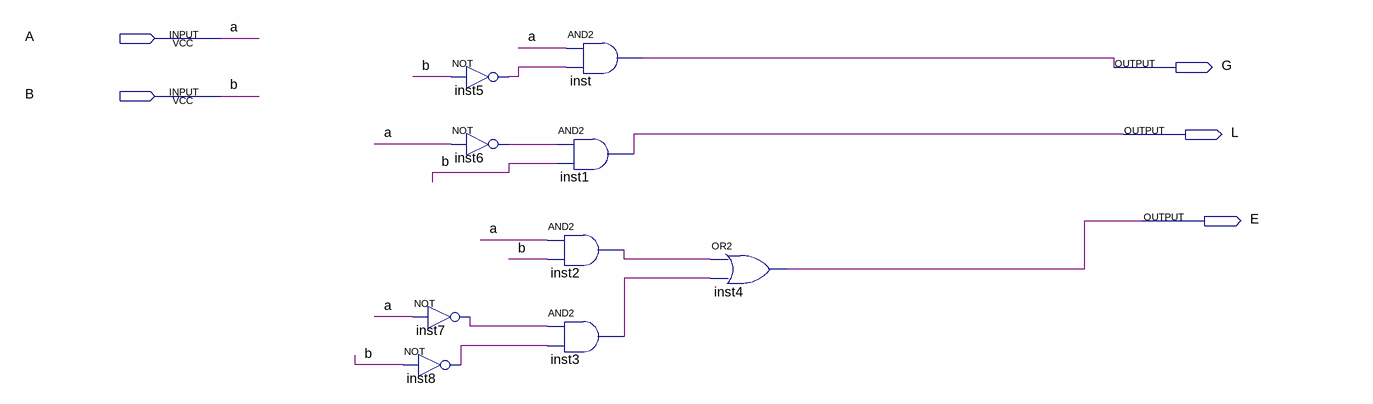
[diagram p0: schematic sheet]
// Quartus schematic Comparator1.bdf as structural Verilog: 9 symbols, 5 pins
module Comparator1 (
  input  A,
  input  B,
  output G,
  output L,
  output E
);

  wire inst2_out, inst3_out, inst5_out, inst6_out, inst7_out, inst8_out;

  not inst5 (inst5_out, B);
  not inst6 (inst6_out, A);
  not inst7 (inst7_out, A);
  not inst8 (inst8_out, B);
  and inst (G, A, inst5_out);
  and inst1 (L, inst6_out, B);
  and inst2 (inst2_out, A, B);
  and inst3 (inst3_out, inst7_out, inst8_out);
  or inst4 (E, inst2_out, inst3_out);
endmodule
